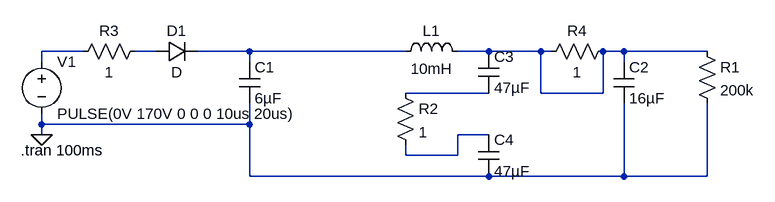
[diagram p0: schematic output dampening.asc]
output dampening.asc, the LTspice schematic file:
Version 4
SHEET 1 992 680
WIRE -48 128 -112 128
WIRE 64 128 32 128
WIRE 208 128 128 128
WIRE 448 128 208 128
WIRE 576 128 528 128
WIRE 656 128 576 128
WIRE 672 128 656 128
WIRE 784 128 752 128
WIRE 912 128 784 128
WIRE -112 144 -112 128
WIRE 208 144 208 128
WIRE 784 144 784 128
WIRE 576 192 448 192
WIRE 656 192 656 128
WIRE 752 192 752 128
WIRE 752 192 656 192
WIRE -112 240 -112 224
WIRE 208 240 208 208
WIRE 208 240 -112 240
WIRE -112 256 -112 240
WIRE 576 256 528 256
WIRE 448 288 448 272
WIRE 528 288 528 256
WIRE 528 288 448 288
WIRE 208 320 208 240
WIRE 576 320 208 320
WIRE 784 320 784 208
WIRE 784 320 576 320
WIRE 912 320 912 208
WIRE 912 320 784 320
FLAG -112 256 0
SYMBOL voltage -112 128 R0
WINDOW 123 0 0 Left 0
WINDOW 39 0 0 Left 0
SYMATTR InstName V1
SYMATTR Value PULSE(0V 170V 0 0 0 10us 20us)
SYMBOL cap 192 144 R0
SYMATTR InstName C1
SYMATTR Value 6µF
SYMBOL cap 768 144 R0
SYMATTR InstName C2
SYMATTR Value 16µF
SYMBOL ind 432 144 R270
WINDOW 0 32 56 VTop 2
WINDOW 3 5 56 VBottom 2
SYMATTR InstName L1
SYMATTR Value 10mH
SYMBOL res 896 112 R0
SYMATTR InstName R1
SYMATTR Value 200k
SYMBOL res 432 176 R0
SYMATTR InstName R2
SYMATTR Value 1
SYMBOL cap 560 128 R0
SYMATTR InstName C3
SYMATTR Value 47µF
SYMBOL res 48 112 R90
WINDOW 0 0 56 VBottom 2
WINDOW 3 32 56 VTop 2
SYMATTR InstName R3
SYMATTR Value 1
SYMBOL diode 64 144 R270
WINDOW 0 32 32 VTop 2
WINDOW 3 0 32 VBottom 2
SYMATTR InstName D1
SYMBOL res 768 112 R90
WINDOW 0 0 56 VBottom 2
WINDOW 3 32 56 VTop 2
SYMATTR InstName R4
SYMATTR Value 1
SYMBOL cap 560 256 R0
SYMATTR InstName C4
SYMATTR Value 47µF
TEXT -144 280 Left 2 !.tran 100ms

The netlist it stands for:
* output dampening.asc
V1 N001 0 PULSE(0V 170V 0 0 0 10us 20us)
C1 N003 0 6µF
C2 N004 0 16µF
L1 N003 N004 10mH
R1 N004 0 200k
R2 N005 N006 1
C3 N004 N005 47µF
R3 N002 N001 1
D1 N002 N003 D
R4 N004 N004 1
C4 N006 0 47µF
.model D D
.lib standard.dio
.tran 100ms
.backanno
.end